# Altium project Smartwatch Power Board.PrjPcb
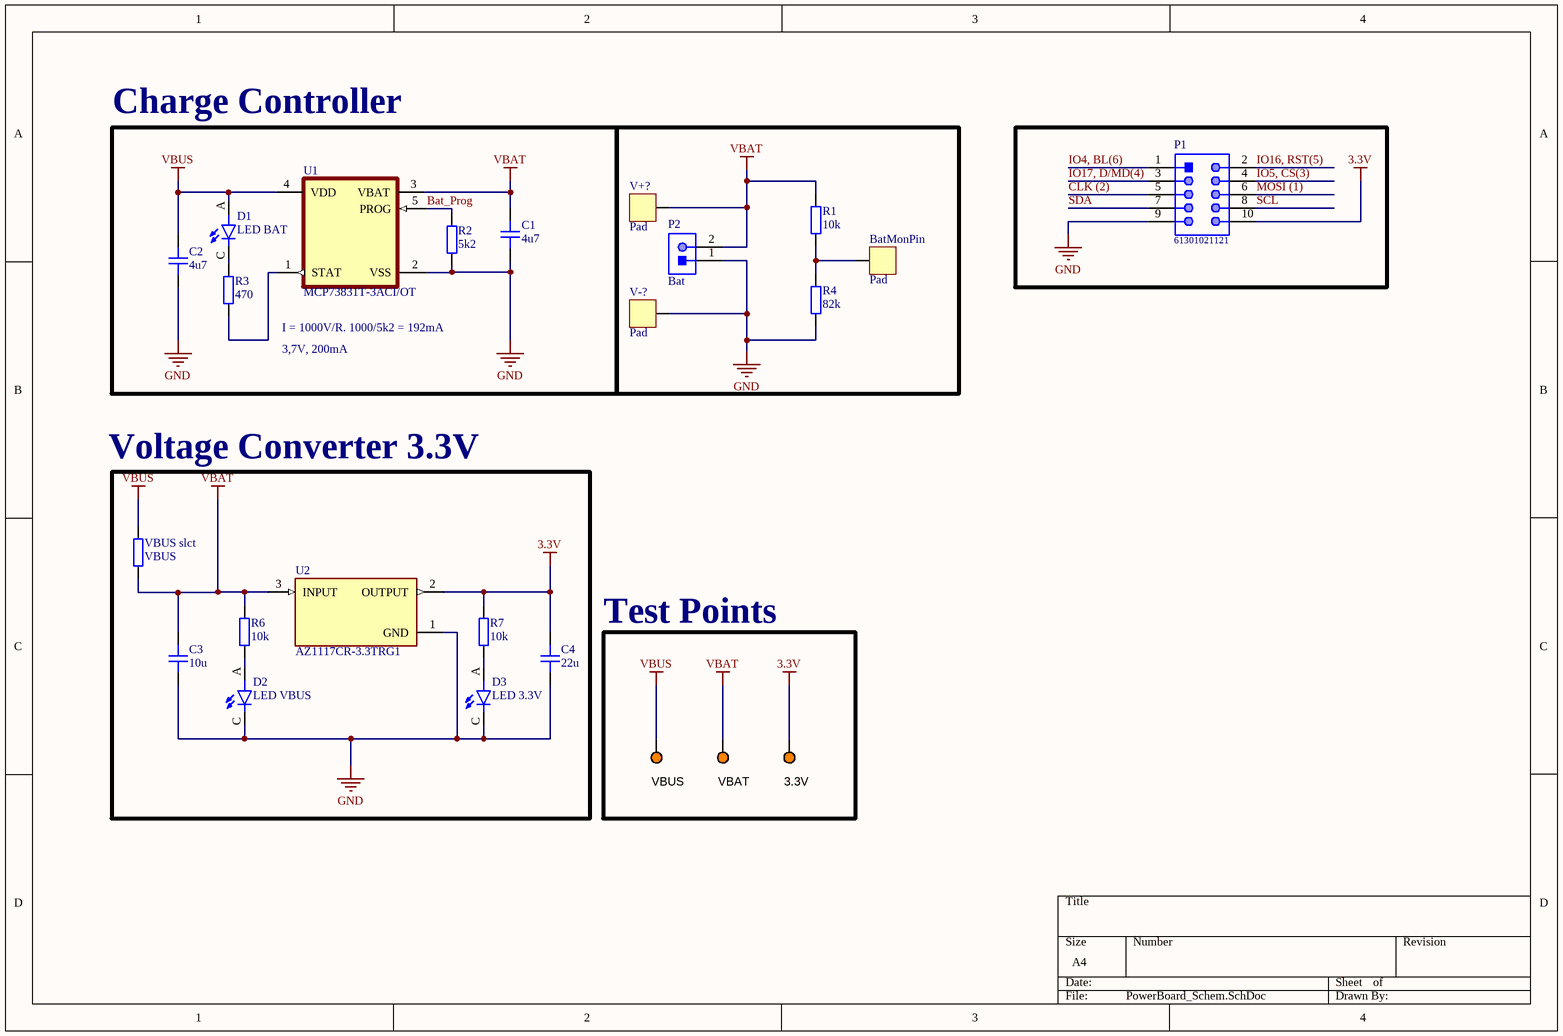
[diagram p0: PowerBoard_Schem.SchDoc]
1 sheet, 24 parts. Net scope: global (net labels, ports and power ports of the same name join across sheets).
Board file: PowerBoard_PCB.PcbDoc

## Sheet PowerBoard_Schem.SchDoc
size A4; SheetNumber: 1; SheetTotal: 1

### Parts
3.3V  5003  [KSTN-5003]  (value not drawn)
BatMonPin  Pad  [PAD_SQ_2MM]
C1  4u7  [CAP_1206]
C2  4u7  [CAP_1206]
C3  10u  [CAP_1206]
C4  22u  [CAP_1206]
D1  LED BAT  [LED_1206]
D2  LED VBUS  [LED_1206]
D3  LED 3.3V  [LED_1206]
P1  61301021121  [61301021121]
P2  Bat  [JST-S2B-PH-K-S_V]
R1  10k  [RES_1206]
R2  5k2  [RES_1206]
R3  470  [RES_1206]
R4  82k  [RES_1206]
R6  10k  [RES_1206]
R7  10k  [RES_1206]
U1  MCP73831T-3ACI/OT  [SOT95P270X145-5N]
U2  AZ1117CR-3.3TRG1  [FP-SOT89-MFG]
V+  Pad  [PAD_SQ_2MM]
V-  Pad  [PAD_SQ_2MM]
VBAT  5003  [KSTN-5003]  (value not drawn)
VBUS  5003  [KSTN-5003]  (value not drawn)
VBUS_slct  VBUS  [RES_0402]

### Blocks framed on the sheet
Charge Controller: C1 C2 D1 R2 R3 U1
Test Points: 3.3V VBAT VBUS

### Nets
3.3V: 3.3V.1 C4.2 P1.10 R7.2 U2.2(OUTPUT)
GND: C1.1 C2.1 C3.1 C4.1 D2.C D3.C P1.9 P2.1 R2.1 R4.1 U1.2(VSS) U2.1(GND) V-.1
VBAT: C1.2 C3.2 P2.2 R1.2 R6.2 U1.3(VBAT) U2.3(INPUT) V+.1 VBAT.1 VBUS_slct.1
VBUS: C2.2 D1.A U1.4(VDD) VBUS.1 VBUS_slct.2
Bat_Prog: R2.2 U1.5(PROG)
CLK (2): P1.5
IO4, BL(6): P1.1
IO5, CS(3): P1.4
IO16, RST(5): P1.2
IO17, D/MD(4): P1.3
MOSI (1): P1.6
SCL: P1.8
SDA: P1.7
NetBatMonPin_1: BatMonPin.1 R1.1 R4.2
NetD1_C: D1.C R3.2
NetD2_A: D2.A R6.1
NetD3_A: D3.A R7.1
NetR3_1: R3.1 U1.1(STAT)

### Notes on the sheet
- I = 1000V/R. 1000/5k2 = 192mA
- 3,7V, 200mA
- Voltage Converter 3.3V

### Library data of the parts
3.3V VBAT VBUS = CMP-002-00037-2: Test Point, Orange, Height 4.6 mm, Tail Length 3 mm, 1-Pin THD, RoHS; Manufacturer: Keystone; Colour: Orange; Packaging: Bulk; Package Description: 1-Pin Through Hole Device, Dia 2.54 mm; Pins: 1; Package Reference: 5003; Datasheet Version: Jun-15; Case/Package: 5003; Mounting Technology: TH; Connector Type: TestPoint; Diameter: 2.54mm; Contact Material: Bronze; Datasheet URL: http://keyelco.com/userAssets/file/M65p56.pdf; Manufacturer URL: http://www.keyelco.com/; Package Quantity: 10; Contact Plating: Tin; RoHS Compliant: True
BatMonPin V+ V- = PAD_SQ_2MM: Test Point Square 2mm
C1-C4 = CAP_1206_50V: Capacitor SMD 1206 50V
D1-D3 = LED - 1206: Yellow 587nm LED Indication - Discrete 2V 1206 _3216 Metric_; MF: Lite-On Inc.; MP: LTST-C230KSKT; Value: *; SnapEDA_Link: https://www.snapeda.com/parts/LTST-C230KSKT/Lite-On%20Inc./view-part/264912/?ref=snap; Availability: Unavailable; Package: 1206 Lite-On; Price: None
P1 = CMP-1502-01084-1: THT Vertical Pin Header WR-PHD, Pitch 2.54 mm, Dual Row, 10 pins; Manufacturer: Wurth Elektronik; Working Voltage: 250VAC; Pitch: 2.54mm; Contact Resistance: 20mOhm; Gender: Male; Rated Current: 3A; Withstanding Voltage: 500VAC; Pin Number: 10; Operating Temperature: -40to105degC; Mounting Technology: THT; Publisher: WurthElektronik; Manufacturer URL: http://www.we-online.de; Part Number: 61301021121; Row Number: Dual; Packaging: Bag; Orientation: Vertical; Package Reference: 61301021121; Datasheet URL: https://katalog.we-online.de/em/datasheet/6130xx21121.pdf
P2 = CMP-1755-00004-1: Male Header, Pitch 2 mm, 1 x 2 Position, Height 4.8 mm, Tail Length 3.4 mm, -25 to 85 degC, RoHS, Bulk; Case\Package: Radial; Tolerance: 20%; Capacitance: 10 uF; Voltage Rating (DC): 50 V; Packaging: Bulk; ComponentLink1URL: http://www.jst-mfg.com/product/pdf/eng/ePH.pdf; Radiation Hardening: No; Height: 11 mm; Package Quantity: 200; PackageDescription: Male Header, Pitch 2 mm, 1 x 2 Position, Height 4.8 mm, Tail Length 3.4 mm; PackageReference: S2B-PH-K-S; Diameter: 5 mm; Pins: 2; Mount: Through Hole; Max Operating Temperature: 85 degC; Min Operating Temperature: -40 degC; ComponentLink1Description: Datasheet; DatasheetVersion: Dec-12; Length: 11 mm; Lead Pitch: 2 mm; REACH SVHC: No SVHC; Voltage Rating: 50 V; RoHSCompliant: true
R1-R4 R6 R7 = RES_1206: Resistor SMD 1206
U1 = MCP73831T-3ACI/OT: Charger IC Lithium Ion/Polymer SOT-23-5; MF: Microchip; Package: SOT-23-5 Microchip; MP: MCP73831T-3ACI/OT; SnapEDA_Link: https://www.snapeda.com/parts/MCP73831T-3ACI/OT/Microchip/view-part/1099789/?ref=snap; Mouser-Purchase-URL: https://snapeda.com/shop?store=Mouser&id=1099789; Value: *; Arrow_Electronics-Purchase-URL: https://snapeda.com/shop?store=Arrow+Electronics&id=1099789
U2 = CMP-12756-000007-1: IC REG LINEAR 3.3V 800MA SOT89; Manufacturer: Diodes Inc.; Nominal Supply Current: 4mA; Output Type: Fixed; Accuracy Percentage: 1%; Max Junction Temp: +125°C; Max Supply Voltage: 15V; Number Of Outputs: 1; Output Current: 1.35A; Dropout Voltage: 1.2V; Device Class L1: Integrated Circuits (ICs); ComponentLink2URL: https://www.diodes.com/assets/Datasheets/AZ1117C.pdf; Temperature Range High: +125°C; Octopart: https://octopart.com/az1117cr-3.3trg1-diodes+inc.-30954805; Output Voltage: 3.3V; Automotive: No; RoHS: TRUE; Temperature Range Low: -20°C; Package: SOT89; Height: 1.6mm; Mouser Description: DiodesZetex AZ1117CR-3.3TRG1, LDO Regulator, 800mA, 3.3 V, ±1% 3-Pin, SOT-89; Manufacturer Part Number: AZ1117CR-3.3TRG1; ComponentLink2Description: Datasheet; Device Class L2: Power Management ICs; Lead Free: Yes; Device Class L3: Voltage Regulators - Linear; Category: IC; Temperature: -20°C to +125°C; Footprint Url: https://www.diodes.com/assets/Package-Files/SOT89.pdf; Digikey Description: IC REG LINEAR 3.3V 800MA SOT89
VBUS_slct = RES_0402: Resistor SMD 0402